# Altium schematic sheet 7 WiFi.SchDoc
size C; DocumentNumber: 7; SheetNumber: 7; SheetTotal: 17
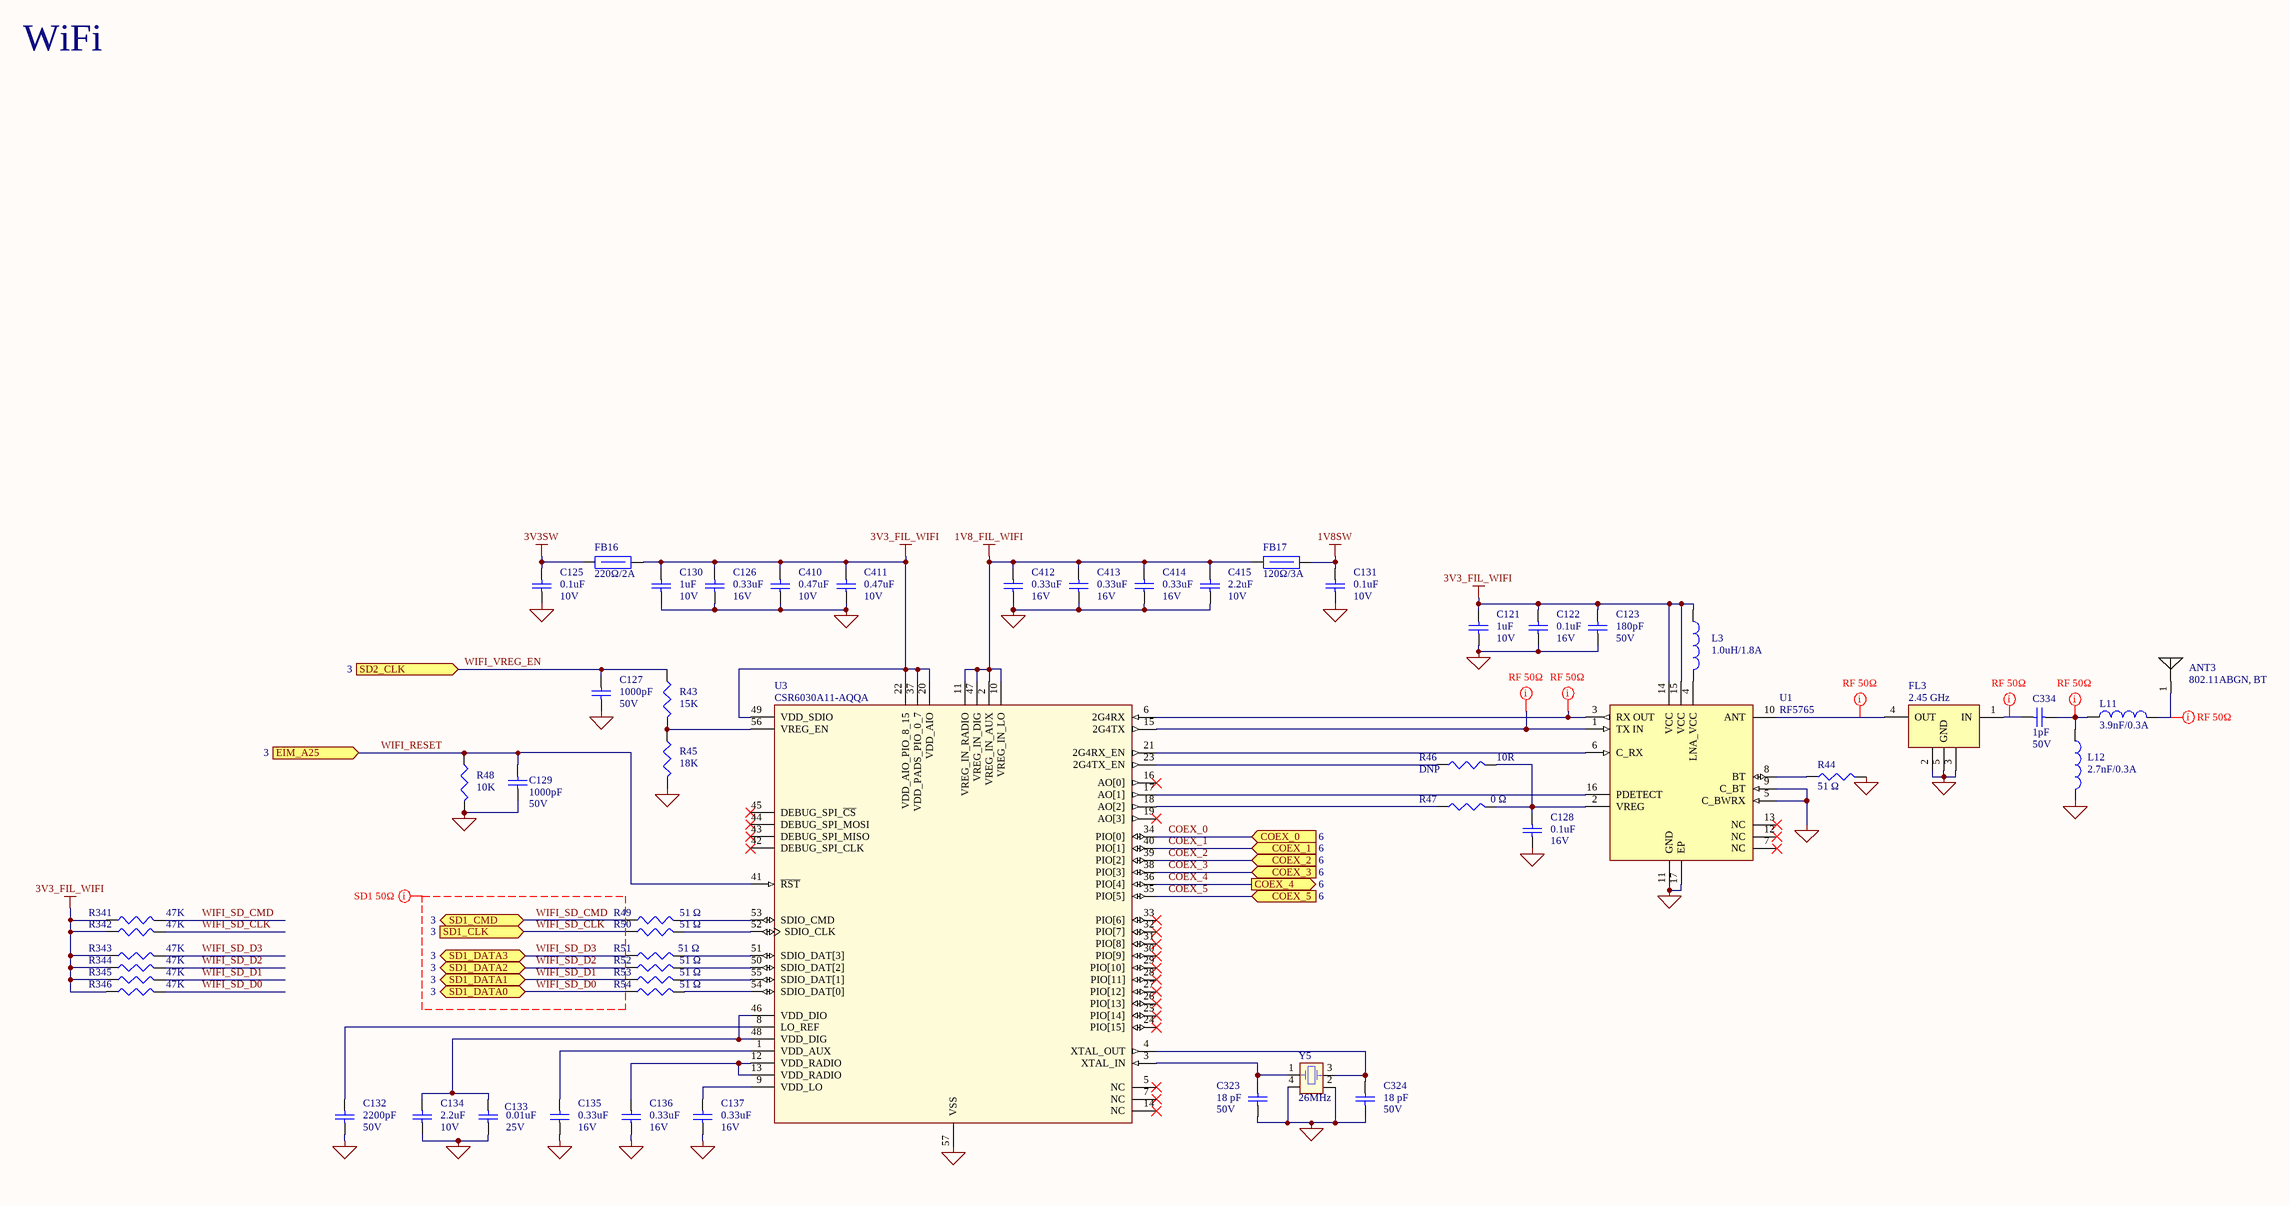
[diagram p0: 7 WiFi.SchDoc]

## Parts
ANT3  value 802.11ABGN, BT  [ANT_2450AT18A100E]  (hidden comment: 2450AT18A100E)
C121  value 1uF  Voltage: 10V  [CAP_0402]  (hidden comment: Cap 1uF 10V 0402)
C122  value 0.1uF  Voltage: 16V  [CAP_0402]  (hidden comment: Cap 0.1uF 16V 0402)
C123  value 180pF  Voltage: 50V  [CAP_0402]  (hidden comment: Cap 180pF 50V 0402)
C125  value 0.1uF  Voltage: 10V  [CAP_0402]  (hidden comment: Cap 0.1uF 10V 0402)
C126  value 0.33uF  Voltage: 16V  [CAP_0402]  (hidden comment: Cap 0.33uF 16V 0402)
C127  value 1000pF  Voltage: 50V  [CAP_0603]  (hidden comment: Cap 1000pF 50V 0603)
C128  value 0.1uF  Voltage: 16V  [CAP_0402]  (hidden comment: Cap 0.1uF 16V 0402)
C129  value 1000pF  Voltage: 50V  [CAP_0603]  (hidden comment: Cap 1000pF 50V 0603)
C130  value 1uF  Voltage: 10V  [CAP_0402]  (hidden comment: Cap 1uF 10V 0402)
C131  value 0.1uF  Voltage: 10V  [CAP_0402]  (hidden comment: Cap 0.1uF 10V 0402)
C132  value 2200pF  Voltage: 50V  [CAP_0402]  (hidden comment: Cap 2200pF 50V 0402)
C133  value 0.01uF  Voltage: 25V  [CAP_0402]  (hidden comment: Cap 0.01uF 50V 0402)
C134  value 2.2uF  Voltage: 10V  [CAP_0402]  (hidden comment: Cap 2.2uF 10V 0402)
C135  value 0.33uF  Voltage: 16V  [CAP_0402]  (hidden comment: Cap 0.33uF 16V 0402)
C136  value 0.33uF  Voltage: 16V  [CAP_0402]  (hidden comment: Cap 0.33uF 16V 0402)
C137  value 0.33uF  Voltage: 16V  [CAP_0402]  (hidden comment: Cap 0.33uF 16V 0402)
C323  value 18 pF  Voltage: 50V  [CAP_0402]  (hidden comment: Cap 18pF 50V 0402)
C324  value 18 pF  Voltage: 50V  [CAP_0402]  (hidden comment: Cap 18pF 50V 0402)
C334  value 1pF  Voltage: 50V  [CAP_0402]  (hidden comment: Cap 1pF 50V 0402 RF)
C410  value 0.47uF  Voltage: 10V  [CAP_0402]  (hidden comment: Cap 0.47uF 10V 0402)
C411  value 0.47uF  Voltage: 10V  [CAP_0402]  (hidden comment: Cap 0.47uF 10V 0402)
C412  value 0.33uF  Voltage: 16V  [CAP_0402]  (hidden comment: Cap 0.33uF 16V 0402)
C413  value 0.33uF  Voltage: 16V  [CAP_0402]  (hidden comment: Cap 0.33uF 16V 0402)
C414  value 0.33uF  Voltage: 16V  [CAP_0402]  (hidden comment: Cap 0.33uF 16V 0402)
C415  value 2.2uF  Voltage: 10V  [CAP_0402]  (hidden comment: Cap 2.2uF 10V 0402)
FB16  value 220Ω/2A  [IND_0805]  (hidden comment: BKP2125HS221-T)
FB17  value 120Ω/3A  [IND_0603]  (hidden comment: BLM18KG121TN1D)
FL3  value 2.45 GHz  [SMD(1.3x1.1)_B39252B9430M410]  (hidden comment: B39252B9430M410)
L3  value 1.0uH/1.8A  [IND_VLS252010T-1R0N]  (hidden comment: VLS252010T-1R0N)
L11  value 3.9nF/0.3A  [IND_RF_0402]  (hidden comment: L-07C3N9SV6T)
L12  value 2.7nF/0.3A  [IND_RF_0402]  (hidden comment: L-07C2N7SV6T)
R43  value 15K  [RES_0402]  (hidden comment: Res 15K 0.1W)
R44  value 51 Ω  [RES_0402]  (hidden comment: Res 51R 0.063W)
R45  value 18K  [RES_0402]  (hidden comment: Res 18K 0.063W)
R46  value 10R  [RES_0402]  (hidden comment: Res 10R 0.1W)
R47  value 0 Ω  [RES_0402]  (hidden comment: Res 0 ohm 0.1W)
R48  value 10K  [RES_0402]  (hidden comment: Res 10K 0.063W)
R49  value 51 Ω  [RES_0402]  (hidden comment: Res 51R 0.063W)
R50  value 51 Ω  [RES_0402]  (hidden comment: Res 51R 0.063W)
R51  value 51 Ω  [RES_0402]  (hidden comment: Res 51R 0.063W)
R52  value 51 Ω  [RES_0402]  (hidden comment: Res 51R 0.063W)
R53  value 51 Ω  [RES_0402]  (hidden comment: Res 51R 0.063W)
R54  value 51 Ω  [RES_0402]  (hidden comment: Res 51R 0.063W)
R341  value 47K  [RES_0402]  (hidden comment: Res 47K 0.1W)
R342  value 47K  [RES_0402]  (hidden comment: Res 47K 0.1W)
R343  value 47K  [RES_0402]  (hidden comment: Res 47K 0.1W)
R344  value 47K  [RES_0402]  (hidden comment: Res 47K 0.1W)
R345  value 47K  [RES_0402]  (hidden comment: Res 47K 0.1W)
R346  value 47K  [RES_0402]  (hidden comment: Res 47K 0.1W)
U1  RF5765  [QFN-16_RF5765]
U3  CSR6030A11-AQQA  [QFN-56_CSR6030A11-AQQA]
Y5  value 26MHz  [DFN(3.2x2.5)_403I35D26M00000]  (hidden comment: 403I35D26M00000)

## Ports
COEX_0 (in, see 6), COEX_1 (in, see 6), COEX_2 (in, see 6), COEX_3 (in, see 6), COEX_4 (out, see 6), COEX_5 (in, see 6), EIM_A25 (in, see 3), SD1_CLK (in, see 3), SD1_CMD (bidir, see 3), SD1_DATA0 (bidir, see 3), SD1_DATA1 (bidir, see 3), SD1_DATA2 (bidir, see 3), SD1_DATA3 (bidir, see 3), SD2_CLK (in, see 3)

## Nets
1V8_FIL_WIFI: C412.1 C413.1 C414.1 C415.1 FB17.1 U3.2(VREG_IN_AUX) U3.10(VREG_IN_LO) U3.11(VREG_IN_RADIO) U3.47(VREG_IN_DIG)
1V8SW: C131.1 FB17.2
3V3_FIL_WIFI: C121.1 C122.1 C123.1 C126.1 C130.1 C410.1 C411.1 FB16.2 L3.1 R341.1 R342.1 R343.1 R344.1 R345.1 R346.1 U1.14(VCC) U1.15(VCC) U3.20(VDD_AIO) U3.22(VDD_AIO_PIO_8_15) U3.37(VDD_PADS_PIO_0_7) U3.49(VDD_SDIO)
3V3SW: C125.1 FB16.1
GND: C121.2 C122.2 C123.2 C125.2 C126.2 C127.2 C128.2 C129.2 C130.2 C131.2 C132.2 C133.2 C134.2 C135.2 C136.2 C137.2 C323.2 C324.2 C410.2 C411.2 C412.2 C413.2 C414.2 C415.2 FL3.2(GND) FL3.3(GND) FL3.5(GND) L12.2 R44.2 R45.2 R48.2 U1.5(C_BWRX) U1.9(C_BT) U1.11(GND) U1.17(EP) U3.57(VSS) Y5.2 Y5.4
COEX_0: U3.34(PIO[0]) ; port COEX_0
COEX_1: U3.40(PIO[1]) ; port COEX_1
COEX_2: U3.39(PIO[2]) ; port COEX_2
COEX_3: U3.38(PIO[3]) ; port COEX_3
COEX_4: U3.36(PIO[4]) ; port COEX_4
COEX_5: U3.35(PIO[5]) ; port COEX_5
WIFI_RESET: C129.1 R48.1 U3.41(~{RST}) ; port EIM_A25
WIFI_SD_CLK: R50.1 R342.2 ; port SD1_CLK
WIFI_SD_CMD: R49.1 R341.2 ; port SD1_CMD
WIFI_SD_D0: R54.1 R346.2 ; port SD1_DATA0
WIFI_SD_D1: R53.1 R345.2 ; port SD1_DATA1
WIFI_SD_D2: R52.1 R344.2 ; port SD1_DATA2
WIFI_SD_D3: R51.1 R343.2 ; port SD1_DATA3
WIFI_VREG_EN: C127.1 R43.1 ; port SD2_CLK
NetANT3_1: ANT3.1 L11.2
NetC128_1: C128.1 R46.2 R47.2 U1.2(VREG)
NetC132_1: C132.1 U3.8(LO_REF)
NetC133_1: C133.1 C134.1 U3.46(VDD_DIO) U3.48(VDD_DIG)
NetC135_1: C135.1 U3.1(VDD_AUX)
NetC136_1: C136.1 U3.12(VDD_RADIO) U3.13(VDD_RADIO)
NetC137_1: C137.1 U3.9(VDD_LO)
NetC323_1: C323.1 U3.3(XTAL_IN) Y5.1(OSC1)
NetC324_1: C324.1 U3.4(XTAL_OUT) Y5.3(OSC2)
NetC334_1: C334.1 FL3.1(IN)
NetC334_2: C334.2 L11.1 L12.1
NetFL3_4: FL3.4(OUT) U1.10(ANT)
NetL3_2: L3.2 U1.4(LNA_VCC)
NetR43_2: R43.2 R45.1 U3.56(VREG_EN)
NetR44_1: R44.1 U1.8(BT)
NetR46_1: R46.1 U3.23(2G4TX_EN)
NetR47_1: R47.1 U3.18(AO[2])
NetR49_2: R49.2 U3.53(SDIO_CMD)
NetR50_2: R50.2 U3.52(SDIO_CLK)
NetR51_2: R51.2 U3.51(SDIO_DAT[3])
NetR52_2: R52.2 U3.50(SDIO_DAT[2])
NetR53_2: R53.2 U3.55(SDIO_DAT[1])
NetR54_2: R54.2 U3.54(SDIO_DAT[0])
NetU1_1: U1.1(TX_IN) U3.15(2G4TX)
NetU1_3: U1.3(RX_OUT) U3.6(2G4RX)
NetU1_6: U1.6(C_RX) U3.21(2G4RX_EN)
NetU1_16: U1.16(PDETECT) U3.17(AO[1])

Not connected (* = marked no-connect by the designer): U1 7(NC)* 12(NC)* 13(NC)*; U3 5(NC)* 7(NC)* 14(NC)* 16(AO[0])* 19(AO[3])* 24(PIO[15])* 25(PIO[14])* 26(PIO[13])* 27(PIO[12])* 28(PIO[11])* 29(PIO[10])* 30(PIO[9])* 31(PIO[8])* 32(PIO[7])* 33(PIO[6])* 42(DEBUG_SPI_CLK)* 43(DEBUG_SPI_MISO)* 44(DEBUG_SPI_MOSI)* 45(DEBUG_SPI_~{CS})*

## Layout directives
net class RF 50ohm: NetANT3_1, NetC334_1, NetC334_2, NetFL3_4, NetU1_1, NetU1_3
net class SD1 50ohm: WIFI_SD_CLK, WIFI_SD_CMD, WIFI_SD_D0, WIFI_SD_D1, WIFI_SD_D2, WIFI_SD_D3

## Notes on the sheet
- WiFi
- First View Consultants
- Austin, Tx
- 512.582.9102
- firstviewconsultants.com
- Title:
- File:
- Drawn:
- Sheet
- of
- FVC #:
- Checked:
- Approved:
- Date:
- Page Size:
- C
- Rev.
- Time:

## Library data of the parts
ANT3 = 2450AT18A100E: Antenna, WiFi/BT, SMD; Manufacturer: Johanson Technology, Inc.; Manufacturer #: 2450AT18A100E
C121 C130 = Cap 1uF 10V 0402: Cap, Cer, 1uF, 10V, ±10%, X5R, 0402; Manufacturer #: CC0402KRX5R6BB105; Manufacturer: Yageo; Have Footprint: yes; Package: 0402
C122 C128 = Cap 0.1uF 16V 0402: Cap, Cer, 0.1uF, 16V, 10%, X7R, 0402; Manufacturer #: GRM155R71C104KA88D; Manufacturer: Murata Electronics North America; Have Footprint: yes; Package: 0402; Tolerance: ±10%
C123 = Cap 180pF 50V 0402: Cap, Cer, 180pF, 50V, 5%, NP0, 0402; Manufacturer: Murata Electronics North America; Manufacturer #: GRM1555C1H181JA01J; Have Footprint: yes; Tolerance: 5%; PACKAGE: 0402
C125 C131 = Cap 0.1uF 10V 0402: Cap, Cer, 0.1uF, 10V, 10%, X5R, 0402; Manufacturer: Murata Electronics North America; Manufacturer #: GRM155R61A104KA01J; Have Footprint: yes; Tolerance: ±10%; PACKAGE: 0402
C126 C135-C137 C412-C414 = Cap 0.33uF 16V 0402: Cap, Cer, 0.33uF, 16V, 10%, X5R, 0402; Manufacturer: TDK Corporation; Manufacturer #: C1005X5R1C334K050BC; Have Footprint: yes; Tolerance: 10%; PACKAGE: 0402
C127 C129 = Cap 1000pF 50V 0603: Cap, Cer, 1000pF, 50V, 10%, X7S, 0603; Manufacturer: Yageo; Manufacturer #: CC0603KRX7R9BB102; Have Footprint: yes; Tolerance: 10%; PACKAGE: 0402
C132 = Cap 2200pF 50V 0402: Cap, Cer, 2200pF, 50V, 5%, X7R, 0402; Manufacturer #: GRM155R71H222JA01J; Manufacturer: Murata Electronics North America; Have Footprint: yes; Package: 0402; Tolerance: 5%
C133 = Cap 0.01uF 50V 0402: Cap, Cer, 0.01uF, 25V, ±10%, X7R, 0402; Manufacturer #: GRM155R71E103KA01J; Manufacturer: Murata; Have Footprint: yes; Tolerance: ±10%; Package: 0402
C134 C415 = Cap 2.2uF 10V 0402: Cap, Cer, 2.2uF, 10V, 10%, X5R, 0402; Manufacturer #: C0402C225M8PACTU; Manufacturer: Kemet; Have Footprint: yes; Package: 0402
C323 C324 = Cap 18pF 50V 0402: Cap, Cer, 18pF, 50V, 5%, C0G, 0402; Manufacturer #: C1005C0G1H180J050BA; Manufacturer: TDK Corporation; Have Footprint: yes; Package: 0402
C334 = Cap 1pF 50V 0402 RF: Cap, Cer, 0.1uF, 50V, 10%, X5R, 0402; Manufacturer #: CBR04C109C5GAC; Manufacturer: Kemet; Have Footprint: yes; Tolerance: ±10%; PACKAGE: 0402
C410 C411 = Cap 0.47uF 10V 0402: Cap, Cer, 0.47uF, 10V, 10%, X5R, 0402; Manufacturer: TDK Corporation; Manufacturer #: C1005X5R1A474K050BB; Have Footprint: yes; Package: 0402; Tolerance: ±10%
FB16 = BKP2125HS221-T: Ind, Ferrite Bead, 220R, 50mOhm, 2A, 0805; Manufacturer: Taiyo Yuden; Manufacturer #: BKP2125HS221-T; Package: 0805
FB17 = BLM18KG121TN1D: Ind, Ferrite Bead, 120R, 20mOhm, 3A, 0603; Manufacturer: Murata Electronics North America; Have Footprint: yes; RoHS: yes; Package: 0603; Manufacturer #: BLM18KG121TN1D
FL3 = B39252B9430M410: Filter, Saw, 2.45 GHz, WLAN, SMD; Manufacturer: EPCOS (TDK); Package: SMD (1.4x1.1); RoHS: yes; Manufacturer #: B39252B9430M410
L3 = VLS252010T-1R0N: Ind, Power, 1uH, 1.8A, 85mOhm, Shielded, SMD; Manufacturer: TDK Corporation; Tolerance: ±20%; Package: SMD (2.5x2); Manufacturer #: VLS252010T-1R0N
L11 = L-07C3N9SV6T: Ind, RF, 3.9nH, 0.3A, 220 mOhm, 0402; Manufacturer: Johanson Technology Inc; RoHS: yes; Operating Temperature: -40°C ~ 100°C; Package: 0402; Manufacturer #: L-07C3N9SV6T
L12 = L-07C2N7SV6T: Ind, RF, 2.7nH, 0.3A, 170 mOhm, 0402; Manufacturer: Johanson Technology Inc; RoHS: yes; Operating Temperature: -40°C ~ 100°C; Package: 0402; Manufacturer #: L-07C2N7SV6T
R43 = Res 15K 0.1W: Res, 15K, 0.1W, 1%, 0402; Manufacturer #: ERJ-2GEJ153X; Manufacturer: Panasonic Electronic Components; Have Footprint: yes; Package: 0402
R44 R49-R54 = Res 51R 0.063W: Res, 51R, 0.063W, 1%, 0402; Manufacturer #: MCR01MRTF51R0; Manufacturer: Rohm Semiconductor; Have Footprint: yes; Package: 0402
R45 = Res 18K 0.063W: Res, 18K, 0.063W, 1%, 0402; Manufacturer #: MCR01MRTF1802; Manufacturer: Rohm Semiconductor; Have Footprint: yes; Package: 0402; Tolerance: 1%
R46 = Res 10R 0.1W: Res, 10R, 0.1W, 0402; Manufacturer #: ERJ-2GEJ100X; Manufacturer: Panasonic Electronic Components; Have Footprint: yes; DNP: DNP; Package: 0402
R47 = Res 0 ohm 0.1W: Res, 0 ohm, 1/16W, 0402; Manufacturer #: CRCW04020000Z0ED; Manufacturer: Vishay Dale; Have Footprint: yes; Package: 0402
R48 = Res 10K 0.063W: Res, 10K, 1/16W, 1%, 0402; Manufacturer #: RC0402FR-0710KL; Manufacturer: Yageo; Have Footprint: yes; Package: 0402
R341-R346 = Res 47K 0.1W: Res, 47K, 0.1W, 1%, 0402; Manufacturer #: ERJ-2RKF4702X; Manufacturer: Panasonic Electronic Components; Have Footprint: yes; Package: 0402
U1 = RF5765: IC, WiFi 802.11b/g/n FEM, 3-4.8V, 2.4-2.5GHz, QFN-16; Manufacturer: RFMD; Have Footprint: yes; RoHS: yes; Manufacturer #: RF5765
U3 = CSR6030A11-AQQA: IC, WiFi, QFN-56; Manufacturer: CSR PLC; Value: CSR6030A11-AQQA; Manufacturer #: CSR6030A11-AQQA; Package: QFN-56
Y5 = 403I35D26M00000: Clock, Crystal, 26MHz, 50ppm, 18pf, -40+85°C, SMD; Manufacturer: CTS-Frequency Controls; Package: DFN(3.2x2.5mm); Manufacturer #: 403I35D26M00000